# EAGLE design 16ch_omn_hirose_adapter (EAGLE 7.3.0)
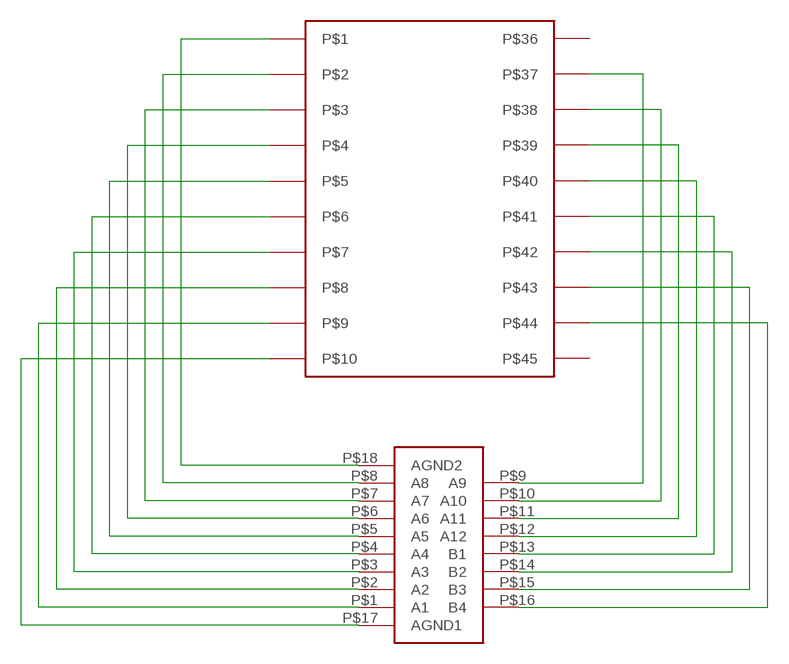
[diagram p0: schematic, sheet 1]

## Parts
U$1  HIROSE_DF40_70PIN  [HIROSE_DF40C-70DS]
U$2  OMNETICS_FE18  [OMNETICS_FE18]

## Nets
N$1: U$1.P$1 U$2.P$18(AGND2)
N$2: U$1.P$2 U$2.P$8(A8)
N$3: U$1.P$3 U$2.P$7(A7)
N$4: U$1.P$4 U$2.P$6(A6)
N$5: U$1.P$5 U$2.P$5(A5)
N$6: U$1.P$6 U$2.P$4(A4)
N$7: U$1.P$7 U$2.P$3(A3)
N$8: U$1.P$8 U$2.P$2(A2)
N$9: U$1.P$9 U$2.P$1(A1)
N$10: U$1.P$10 U$2.P$17(AGND1)
N$11: U$1.P$37 U$2.P$9(A9)
N$12: U$1.P$38 U$2.P$10(A10)
N$13: U$1.P$39 U$2.P$11(A11)
N$14: U$1.P$40 U$2.P$12(A12)
N$15: U$1.P$41 U$2.P$13(B1)
N$16: U$1.P$42 U$2.P$14(B2)
N$17: U$1.P$43 U$2.P$15(B3)
N$18: U$1.P$44 U$2.P$16(B4)
Unconnected: U$1.P$36 U$1.P$45

## Library data of the parts
U$1 = GG_hirose20:HIROSE_DF40_70PIN
U$2 = connectors:OMNETICS_FE18

## Board
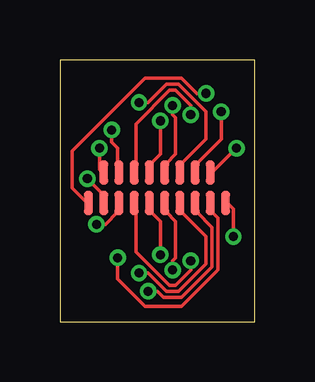
[diagram p1: board, top side]
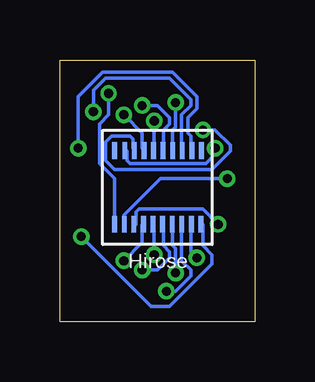
[diagram p2: board, bottom side, seen from below]

Size 8.13 x 10.92 mm. Coordinates in mm from the lower left corner, seen from the top.
Outline: 0,0 8.13,0 8.13,10.92 0,10.92 0,0
Copper layers (1*16): Top 0.035mm / dielectric 1.5mm / Bottom 0.035mm
Design rules "default *": minimum track width 6mil, minimum drill 15mil, track to track 4mil, track to pad 4mil, pad to pad 4mil, via to via 4mil, smd to smd 4mil, copper to edge 20mil, drill to drill 6mil, minimum pad ring 8mil, minimum via ring 6mil, stop-mask expansion 4mil, vias tented up to drill 0mil, thermal gap 10mil

### Footprints (pad centres in the part's own frame; a part is rotated, then mirrored left to right if it is on the bottom)
HIROSE_DF40C-70DS = smd 0.2 x 0.7: P$1 0,0; P$2 -0.4,0; P$3 -0.8,0; P$4 -1.2,0; P$5 -1.6,0; P$6 -2,0; P$7 -2.4,0; P$8 -2.8,0; P$9 -3.2,0; P$10 -3.6,0; P$36 0,-3.08; P$37 -0.42,-3.08; P$38 -0.82,-3.08; P$39 -1.22,-3.08; P$40 -1.62,-3.08; P$41 -2.02,-3.08; P$42 -2.42,-3.08; P$43 -2.82,-3.08; P$44 -3.22,-3.08; P$45 -3.62,-3.08
OMNETICS_FE18 = smd 0.381 x 1.016: P$1 -1.905,0.635; P$2 -1.27,0.635; P$3 -0.635,0.635; P$4 0,0.635; P$5 0.635,0.635; P$6 1.27,0.635; P$7 1.905,0.635; P$8 2.54,0.635; P$9 2.54,-0.635; P$10 1.905,-0.635; P$11 1.27,-0.635; P$12 0.635,-0.635; P$13 0,-0.635; P$14 -0.635,-0.635; P$15 -1.27,-0.635; P$16 -1.905,-0.635; P$17 -2.54,0.635; P$18 3.175,0.635

### Placement (x,y rotation side)
U$1  5.84,4.06 180 bottom
U$2  4.37,5.59 180 top

### Tracks (layer width: path | path; a pad name or v marks a point on that pad's centre or on a via)
N$1  (via drill 0.38)
  Top 0.152: v6.1,9.52 5.71,9.52 5.08,10.16 3.56,10.16 0.51,7.11 0.51,5.59 1.14,4.95 U$2.P$18
  Bottom 0.152: U$1.P$1 5.84,5.97 6.48,6.6 6.48,8.25 6.1,8.64 v6.1,9.52
N$2  (via drill 0.38)
  Top 0.152: v1.14,5.97 1.78,5.33 1.78,4.95 U$2.P$8
  Bottom 0.152: v1.14,5.97 3.94,5.97 5.46,4.45 5.46,4.06 U$1.P$2
N$3  (via drill 0.38)
  Top 0.152: v1.52,4.06 1.9,4.06 2.41,4.57 2.41,4.95 U$2.P$7
  Bottom 0.152: v1.52,4.06 2.16,4.7 4.83,4.7 4.95,4.57 4.95,4.06 U$1.P$3
N$4  (via drill 0.38)
  Top 0.152: v5.46,2.54 5.46,2.16 4.83,1.52 4.57,1.52 3.17,2.92 3.17,4.95 U$2.P$6
  Bottom 0.152: v5.46,2.54 4.7,3.3 4.7,4.06 U$1.P$4
N$5  (via drill 0.38)
  Top 0.152: v4.19,2.79 4.19,4.19 3.81,4.57 3.81,4.95 U$2.P$5
  Bottom 0.152: v4.19,2.79 4.19,4.06 U$1.P$5
N$6  (via drill 0.38)
  Top 0.152: v4.7,2.16 4.7,2.54 4.83,2.67 4.83,4.19 4.44,4.57 4.44,4.95 U$2.P$4
  Bottom 0.152: v4.7,2.16 4.06,2.16 3.56,2.67 3.56,2.92 3.81,3.17 3.81,4.06 U$1.P$6
N$7  (via drill 0.38)
  Top 0.152: v3.3,2.03 3.68,2.03 4.44,1.27 4.95,1.27 6.1,2.41 6.1,3.56 5.08,4.57 5.08,4.95 U$2.P$3
  Bottom 0.152: v3.3,2.03 3.3,3.05 3.43,3.17 3.43,4.06 U$1.P$7
N$8  (via drill 0.38)
  Top 0.152: v3.68,1.27 4.06,1.27 4.32,1.02 5.08,1.02 6.35,2.29 6.35,3.94 5.71,4.57 5.71,4.95 U$2.P$2
  Bottom 0.152: v3.68,1.27 3.3,1.27 2.67,1.9 2.67,2.16 3.05,2.54 U$1.P$8
N$9  (via drill 0.38)
  Top 0.152: v2.41,2.67 2.41,1.78 3.56,0.63 5.08,0.63 6.6,2.16 6.6,4.32 6.35,4.57 6.35,4.95 U$2.P$1
  Bottom 0.152: v2.41,2.67 2.67,2.92 2.67,4.06 U$1.P$9
N$10  (via drill 0.38)
  Top 0.152: v7.24,3.56 7.24,4.7 6.98,4.95 U$2.P$17
  Bottom 0.152: v7.24,3.56 4.32,0.63 3.56,0.63 1.78,2.41 1.78,2.79 2.16,3.17 2.16,4.06 U$1.P$10
N$11  (via drill 0.38)
  Top 0.152: v1.65,7.24 1.65,6.35 1.78,6.22 U$2.P$9
  Bottom 0.152: v1.65,7.24 1.65,6.98 2.03,6.6 5.21,6.6 5.33,6.73 5.33,7.11 U$1.P$37
N$12  (via drill 0.38)
  Top 0.152: v2.16,8 2.16,7.49 2.41,7.24 2.41,6.22 U$2.P$10
  Bottom 0.152: v2.16,8 1.65,8 1.02,7.37 1.02,7.11 1.78,6.35 5.84,6.35 6.22,6.73 6.22,7.49 5.97,7.75 5.21,7.75 5.08,7.62 5.08,7.24 U$1.P$38
N$13  (via drill 0.38)
  Top 0.152: v5.46,8.64 5.46,9.02 4.83,9.65 4.57,9.65 3.17,8.25 3.17,6.22 U$2.P$11
  Bottom 0.152: v5.46,8.64 4.7,7.87 4.7,7.24 U$1.P$39
N$14  (via drill 0.38)
  Top 0.152: v4.19,8.38 4.19,6.98 3.81,6.6 3.81,6.22 U$2.P$12
  Bottom 0.152: v4.19,8.38 4.19,7.24 U$1.P$40
N$15  (via drill 0.38)
  Top 0.152: v4.7,9.02 4.7,8.64 4.83,8.51 4.83,6.98 4.44,6.6 4.44,6.22 U$2.P$13
  Bottom 0.152: v4.7,9.02 4.06,9.02 3.56,8.51 3.56,8.25 3.81,8 3.81,7.24 U$1.P$41
N$16  (via drill 0.38)
  Top 0.152: v3.3,9.14 3.68,9.14 4.44,9.91 4.95,9.91 6.1,8.76 6.1,7.62 5.08,6.6 5.08,6.22 U$2.P$14
  Bottom 0.152: v3.3,9.14 3.3,8.13 3.43,8 3.43,7.24 U$1.P$42
N$17  (via drill 0.38)
  Top 0.152: v6.73,8.76 6.73,7.62 5.71,6.6 5.71,6.22 U$2.P$15
  Bottom 0.152: v6.73,8.76 6.73,9.65 6.22,10.16 3.56,10.16 2.67,9.27 2.67,9.02 3.05,8.64 3.05,7.24 U$1.P$43
N$18  (via drill 0.38)
  Top 0.152: v7.37,7.24 6.35,6.22 U$2.P$16
  Bottom 0.152: v7.37,7.24 7.37,9.4 6.35,10.41 3.43,10.41 2.41,9.4 2.41,8.89 2.79,8.51 2.79,7.87 2.67,7.75 2.67,7.24 U$1.P$44